# EAGLE design ECE411 (EAGLE 9.2.0)
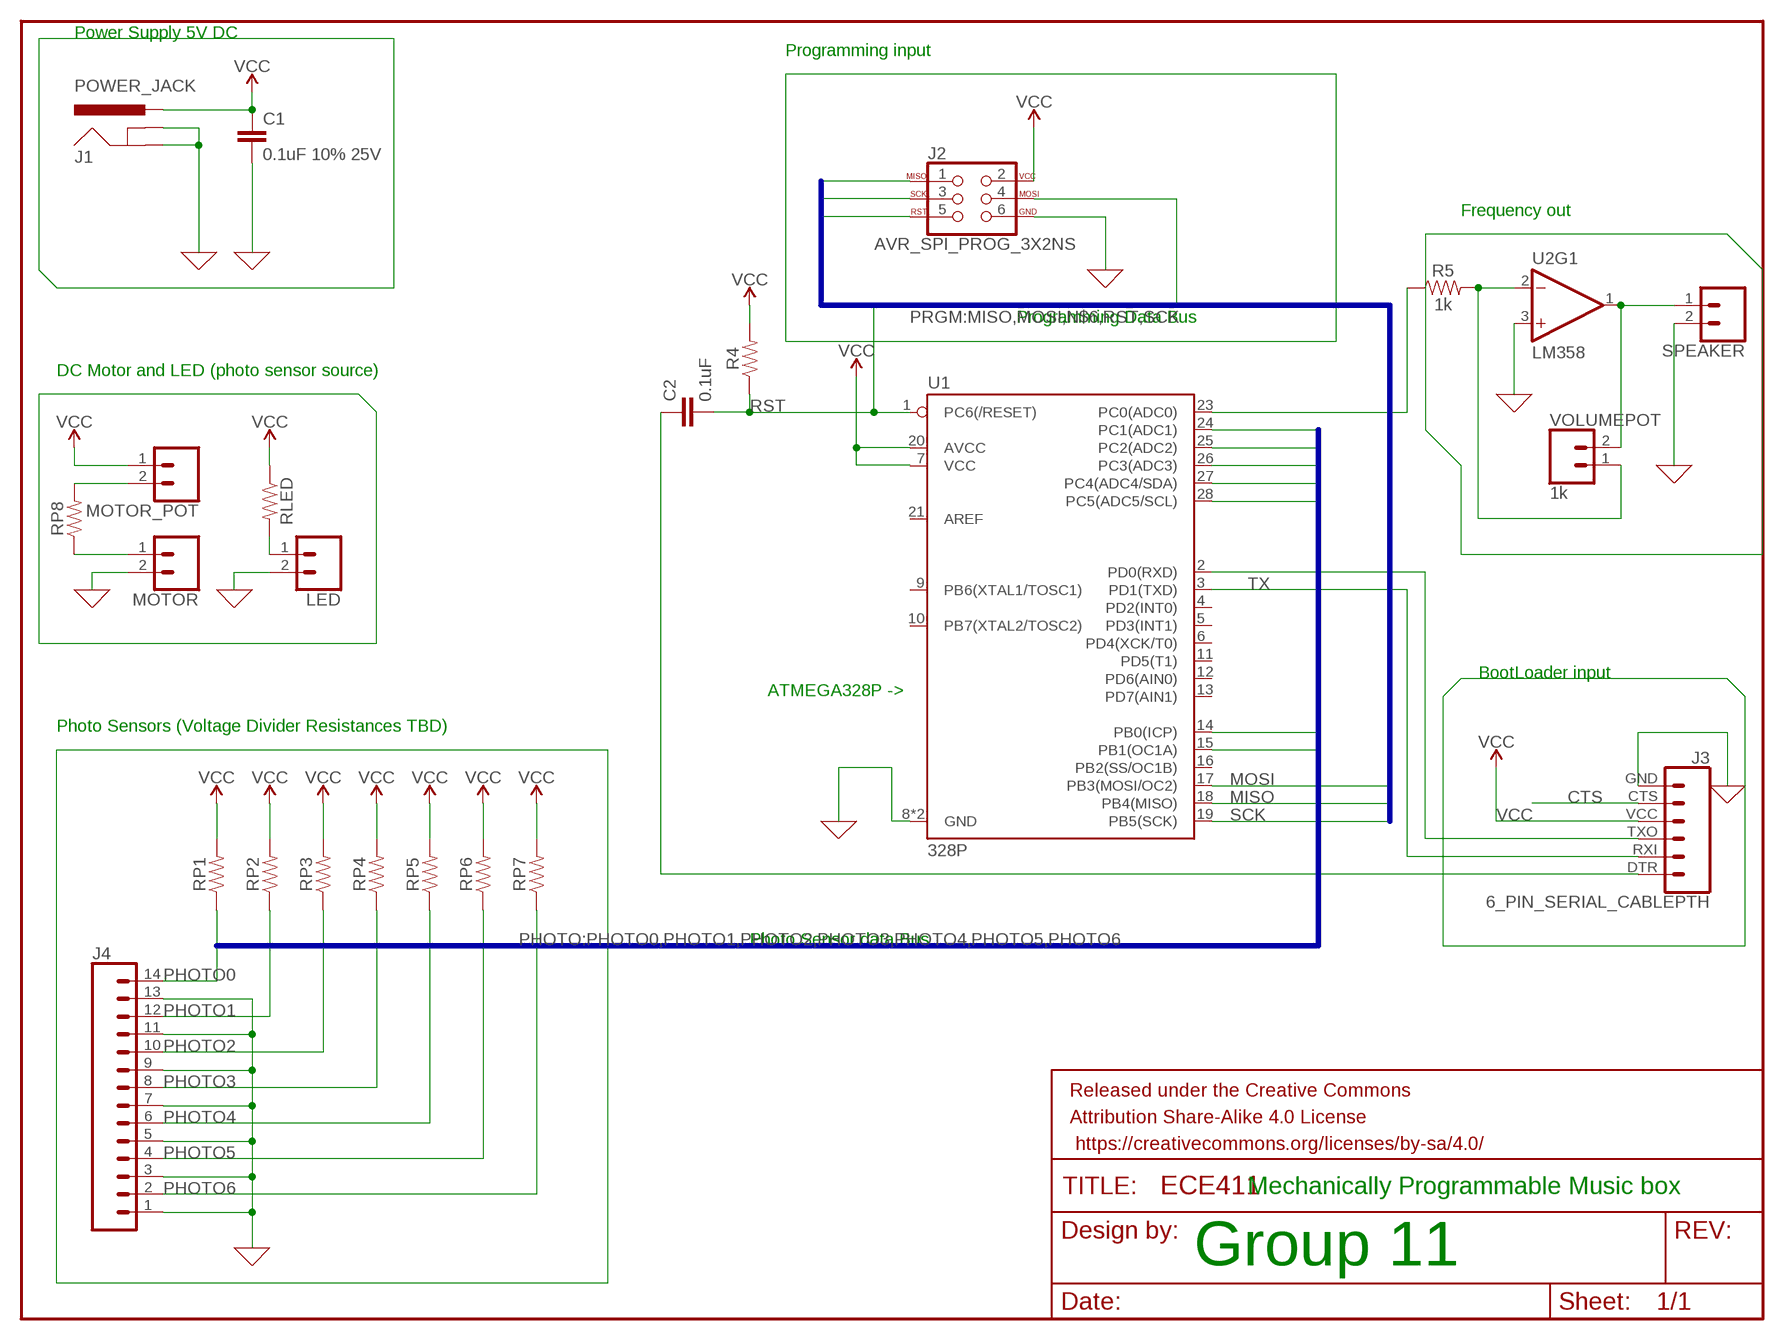
[diagram p0: schematic, sheet 1]

## Parts
C1  0.1uF 10% 25V  0.1UF-0603-25V-(+80/-20%)  [0603]
C2  0.1uF  0.1UF-0603-25V-(+80/-20%)  [0603]
FRAME1  FRAME-LETTER  [CREATIVE_COMMONS]
J1  POWER_JACK  [POWER_JACK_PTH]
J2  AVR_SPI_PROG_3X2NS  [2X3-NS]
J3  6_PIN_SERIAL_CABLEPTH  [FTDI_BASIC]
J4  CONN_14  [1X14]
LED  CONN_02  [1X02]
MOTOR  CONN_02  [1X02]
MOTOR_POT  CONN_02  [1X02]
R4  RESISTOR0805  [0805]
R5  1k  1KOHM-0603-1/10W-1%  [0603]
RLED  RESISTOR0603  [0603]
RP1  RESISTOR0603  [0603]
RP2  RESISTOR0603  [0603]
RP3  RESISTOR0603  [0603]
RP4  RESISTOR0603  [0603]
RP5  RESISTOR0603  [0603]
RP6  RESISTOR0603  [0603]
RP7  RESISTOR0603  [0603]
RP8  RESISTOR0603  [0603]
SPEAKER  CONN_02  [1X02]
U1  328P  ATMEGA328P_PDIP  [DIP28]
U2  LM358  [DIP08]
VOLUMEPOT  1k  CONN_02  [1X02]

## Nets
0: C1.2 J1.GND J1.GNDBREAK J2.6 J3.GND J4.1 J4.3 J4.5 J4.7 J4.9 J4.11 J4.13 LED.2 MOTOR.2 SPEAKER.2 U1.8(GND) U1.22(GND) U2.3(+IN) ; supply symbol labelled GND
CTS: J3.CTS
MISO: J2.1 U1.18(PB4(MISO))
MOSI: J2.4 U1.17(PB3(MOSI/OC2))
N$1: R5.1 U1.23(PC0(ADC0))
N$2: MOTOR_POT.2 RP8.2
N$3: LED.1 RLED.2
N$4: J3.TXO U1.2(PD0(RXD))
N$5: C2.1 J3.DTR
N$7: MOTOR.1 RP8.1
N$8: R5.2 U2.2(-IN) VOLUMEPOT.1
N$9: SPEAKER.1 U2.1(OUT) VOLUMEPOT.2
PHOTO0: J4.14 RP1.1 U1.24(PC1(ADC1))
PHOTO1: J4.12 RP2.1 U1.25(PC2(ADC2))
PHOTO2: J4.10 RP3.1 U1.26(PC3(ADC3))
PHOTO3: J4.8 RP4.1 U1.27(PC4(ADC4/SDA))
PHOTO4: J4.6 RP5.1 U1.28(PC5(ADC5/SCL))
PHOTO5: J4.4 RP6.1 U1.14(PB0(ICP))
PHOTO6: J4.2 RP7.1 U1.15(PB1(OC1A))
RST: C2.2 J2.5 R4.1 U1.1(PC6(/RESET))
SCK: J2.3 U1.19(PB5(SCK))
TX: J3.RXI U1.3(PD1(TXD))
VCC: C1.1 J1.PWR J2.2 J3.VCC MOTOR_POT.1 R4.2 RLED.1 RP1.2 RP2.2 RP3.2 RP4.2 RP5.2 RP6.2 RP7.2 U1.7(VCC) U1.20(AVCC)
Unconnected: U1.4(PD2(INT0)) U1.5(PD3(INT1)) U1.6(PD4(XCK/T0)) U1.9(PB6(XTAL1/TOSC1)) U1.10(PB7(XTAL2/TOSC2)) U1.11(PD5(T1)) U1.12(PD6(AIN0)) U1.13(PD7(AIN1)) U1.16(PB2(SS/OC1B)) U1.21(AREF) U2.4(P$V-) U2.5(+IN) U2.6(-IN) U2.7(OUT) U2.8(P$V+)

## Buses
PHOTO:PHOTO0,PHOTO1,PHOTO2,PHOTO3,PHOTO4,PHOTO5,PHOTO6
PRGM:MISO,MOSI,N$6,RST,SCK

## Notes on the sheet
- Power Supply 5V DC
- Programming input
- Frequency out
- Programming Data Bus
- DC Motor and LED (photo sensor source)
- BootLoader input
- ATMEGA328P ->
- Photo Sensors (Voltage Divider Resistances TBD)
- Photo Sensor data Bus
- Mechanically Programmable Music box
- Group 11

## Library data of the parts
C1 = SparkFun-Capacitors:0.1UF: 0.1µF ceramic capacitors A capacitor is a passive two-terminal electrical component used to store electrical energy temporarily in an electric field.; PROD_ID: CAP-00810; VALUE: 0.1uF
C2 = SparkFun-Capacitors:0.1UF: 0.1µF ceramic capacitors A capacitor is a passive two-terminal electrical component used to store electrical energy temporarily in an electric field.; PROD_ID: CAP-00810
FRAME1 = SparkFun-Aesthetics:FRAME-LETTER: Schematic Frame - Letter Standard 8.5x11 US Letter frame
J1 = SparkFun-Connectors:POWER_JACK: Power Jack Connector This is the standard 5.5mm barrel jack for power. The PTH is the most common, proven, reliable, footprint. The Slot footprint only works if the mill layer is transmitted to the PCB fab house so be warned. Here are the connectors we sell at SparkFun: DC Barrel Power Jack/Connector <https://www.sparkfun.com/products/119> (PRT-00119) DC Barrel Power Jack/Connector (SMD) <https://www.sparkfun.com/products/12748> (PRT-12748) DC Barrel Jack Adapter - Breadboard Compatible <https://www.sparkfun.com/products/10811> (PRT-10811) It is used on this SparkFun product (and many, many others): SparkFun RedBoard - Programmed with Arduino <https://www.sparkfun.com/products/12757> (DEV-12757) Also, if you need a mating power supply or connector, please check these out: Wall Adapter Power Supply - 9VDC 650mA <https://www.sparkfun.com/products/298> (TOL-00298) DC Barrel Jack Adapter - Male <https://www.sparkfun.com/products/10287> (PRT-10287); PROD_ID: CONN-08197
J2 = SparkFun-Connectors:AVR_SPI_PROG_3X2: AVR ISP 6 Pin This is the reduced ISP connector for AVR programming. Common on Arduino. This footprint will take up less PCB space and can be used with a 10-pin to 6-pin adapter such as SKU: BOB-08508 **Special note about "TEST_POINT" package. The stop mask is on the top side, so if you want your programming test points to be on the bottom of your board, make sure to place this package on the bottom side of the board. This also ensure that the orientation to program from the bottom side will be correct. SparkFun Products: SparkFun ISP Pogo Adapter <https://www.sparkfun.com/products/11591> - NS Tiny AVR Programmer <https://www.sparkfun.com/products/11801> -PTH
J3 = SparkFun-Connectors:6_PIN_SERIAL_CABLE: 6-pin header connection for use with the "FTDI BASIC" pinout - CABLE SIDE. Also known as "Arduino Serial Program Header". This is used on a design to provide a 6-pin connection point for serial communication usually from a USB cable (D+/D-) to these headers (RX/TX). It also has the remaining pins necessary for programming in the Arduino evironment (DTR, GND, and sometimes VCC). Note, this device has "CABLE" in the name. It is intended to be used on a design that usually lives on the end of your USB cable and prvides the converter chip (FTDI232 or FTDI231x) to commnicate serial RX/TX. The "sister" device, named "TARGET" is inteneded to be used on a design that contains a target micro-controller that you wish to program. You can populate with some of these: Female Headers <https://www.sparkfun.com/products/115> (PRT-00115) For reference (or to suit your programming needs) check out these designs: SparkFun FTDI Basic Breakout - 5V <https://www.sparkfun.com/products/9716> (DEV-09716) SparkFun FTDI Basic Breakout - 3.3V <https://www.sparkfun.com/products/9873> (DEV-09873) SparkFun FTDI SmartBasic <https://www.sparkfun.com/products/12935> (DEV-12935) SparkFun Beefy 3 - FTDI Basic Breakout <https://www.sparkfun.com/products/13746> (DEV-13746)
J4 = SparkFun-Connectors:CONN_14: Multi connection point. Often used as Generic Header-pin footprint for 0.1 inch spaced/style header connections On any of the 0.1 inch spaced packages, you can populate with these: Break Away Headers - Straight <https://www.sparkfun.com/products/116> (PRT-00116) Break Away Male Headers - Right Angle <https://www.sparkfun.com/products/553> (PRT-00553) Female Headers <https://www.sparkfun.com/products/115> (PRT-00115) Break Away Headers - Machine Pin <https://www.sparkfun.com/products/117> (PRT-00117) Break Away Female Headers - Swiss Machine Pin <https://www.sparkfun.com/products/743> (PRT-00743) For SCREWTERMINALS and SPRING TERMINALS visit here: Screw Terimnals on SparkFun.com <https://www.sparkfun.com/search/results?term=Screw+Terminals> (5mm/3.5mm/2.54mm spacing) This device is also useful as a general connection point to wire up your design to another part of your project. Our various solder wires solder well into these plated through hole pads. Hook-Up Wire - Assortment (Stranded, 22 AWG) <https://www.sparkfun.com/products/11375> (PRT-11375) Hook-Up Wire - Assortment (Solid Core, 22 AWG) <https://www.sparkfun.com/products/11367> (PRT-11367) View the entire wire category on our website here <https://www.sparkfun.com/categories/141> Special notes: Molex polarized connector foot print use with SKU : PRT-08231 with associated crimp pins and housings. 1MM SMD Version SKU: PRT-10208 NOTES ON THE VARIANTS LOCK and LOCK_LONGPADS... This footprint was designed to help hold the alignment of a through-hole component (i.e. 6-pin header) while soldering it into place. You may notice that each hole has been shifted either up or down by 0.005 of an inch from it's more standard position (which is a perfectly straight line). This slight alteration caused the pins (the squares in the middle) to touch the edges of the holes. Because they are alternating, it causes a "brace" to hold the component in place. 0.005 has proven to be the perfect amount of "off-center" position when using our standard breakaway headers. Although looks a little odd when you look at the bare footprint, once you have a header in there, the alteration is very hard to notice. Also,if you push a header all the way into place, it is covered up entirely on the bottom side.
LED MOTOR MOTOR_POT SPEAKER VOLUMEPOT = SparkFun-Connectors:CONN_02: Multi connection point. Often used as Generic Header-pin footprint for 0.1 inch spaced/style header connections On any of the 0.1 inch spaced packages, you can populate with these: Break Away Headers - Straight <https://www.sparkfun.com/products/116> (PRT-00116) Break Away Male Headers - Right Angle <https://www.sparkfun.com/products/553> (PRT-00553) Female Headers <https://www.sparkfun.com/products/115> (PRT-00115) Break Away Headers - Machine Pin <https://www.sparkfun.com/products/117> (PRT-00117) Break Away Female Headers - Swiss Machine Pin <https://www.sparkfun.com/products/743> (PRT-00743) For SCREWTERMINALS and SPRING TERMINALS visit here: Screw Terimnals on SparkFun.com <https://www.sparkfun.com/search/results?term=Screw+Terminals> (5mm/3.5mm/2.54mm spacing) This device is also useful as a general connection point to wire up your design to another part of your project. Our various solder wires solder well into these plated through hole pads. Hook-Up Wire - Assortment (Stranded, 22 AWG) <https://www.sparkfun.com/products/11375> (PRT-11375) Hook-Up Wire - Assortment (Solid Core, 22 AWG) <https://www.sparkfun.com/products/11367> (PRT-11367) View the entire wire category on our website here <https://www.sparkfun.com/categories/141> Special notes: Molex polarized connector foot print use with: PRT-08233 with associated crimp pins and housings. 2.54_SCREWTERM for use with PRT-10571. 3.5mm Screw Terminal footprints for PRT-08084 5mm Screw Terminal footprints for use with PRT-08432
R4 RLED RP1-RP8 = SparkFun-Resistors:RESISTOR: Generic Resistor Package
R5 = SparkFun-Resistors:1KOHM: 1kΩ resistor A resistor is a passive two-terminal electrical component that implements electrical resistance as a circuit element. Resistors act to reduce current flow, and, at the same time, act to lower voltage levels within circuits. - Wikipedia; PROD_ID: RES-07856
U1 = SparkFun-IC-Microcontroller:ATMEGA328P_PDIP: Atmel 328P Through hole ATMEGA328P uC used in the Arduino 32kb flash, 1k EEPROM, 2k SRAM Datasheet <http://www.sparkfun.com/datasheets/Components/SMD/ATMega328.pdf> SparkFun Products Storefront component: AVR 28 Pin 20MHz 32K 6A/D - ATMega328P <https://www.sparkfun.com/products/9061> (COM-09061) SparkFun Simon Says - Through-Hole Soldering Kit <https://www.sparkfun.com/products/10547> (KIT-10547) SparkFun Learn to Solder - Simon Says <https://www.sparkfun.com/products/13708> (KIT-13708) SparkFun BigTime Watch Kit <https://www.sparkfun.com/products/11734> (KIT-11734) SparkFun ClockIt <https://www.sparkfun.com/products/10930> (KIT-10930) SparkFun Serial Enabled LCD Kit <https://www.sparkfun.com/products/10097> (LCD-10097) SparkFun Simon Tilts - Through Hole Soldering Kit <https://www.sparkfun.com/products/12634> (KIT-12634) SparkFun Frequency Counter Kit <https://www.sparkfun.com/products/10140> (KIT-10140) FabFM Radio Kit <https://www.sparkfun.com/products/11043> (KIT-11043) SparkFun Binary Blaster Kit <https://www.sparkfun.com/products/12037> (KIT-12037) SparkFun Metro-Gnome <https://www.sparkfun.com/products/9236> (KIT-09236) ATmega328 with Arduino Optiboot (Uno) <https://www.sparkfun.com/products/10524> (DEV-10524); PROD_ID: IC-09136
U2 = SparkFun-IC-Amplifiers:LM358: LM358 Jellybean op-amp Datasheet <http://www.sparkfun.com/datasheets/Components/General/LM358.pdf> SparkFun Products Op-Amp (Thru-Hole) - LM358 <https://www.sparkfun.com/products/9456> (COM-09456); PROD_ID: IC-09172

## Board
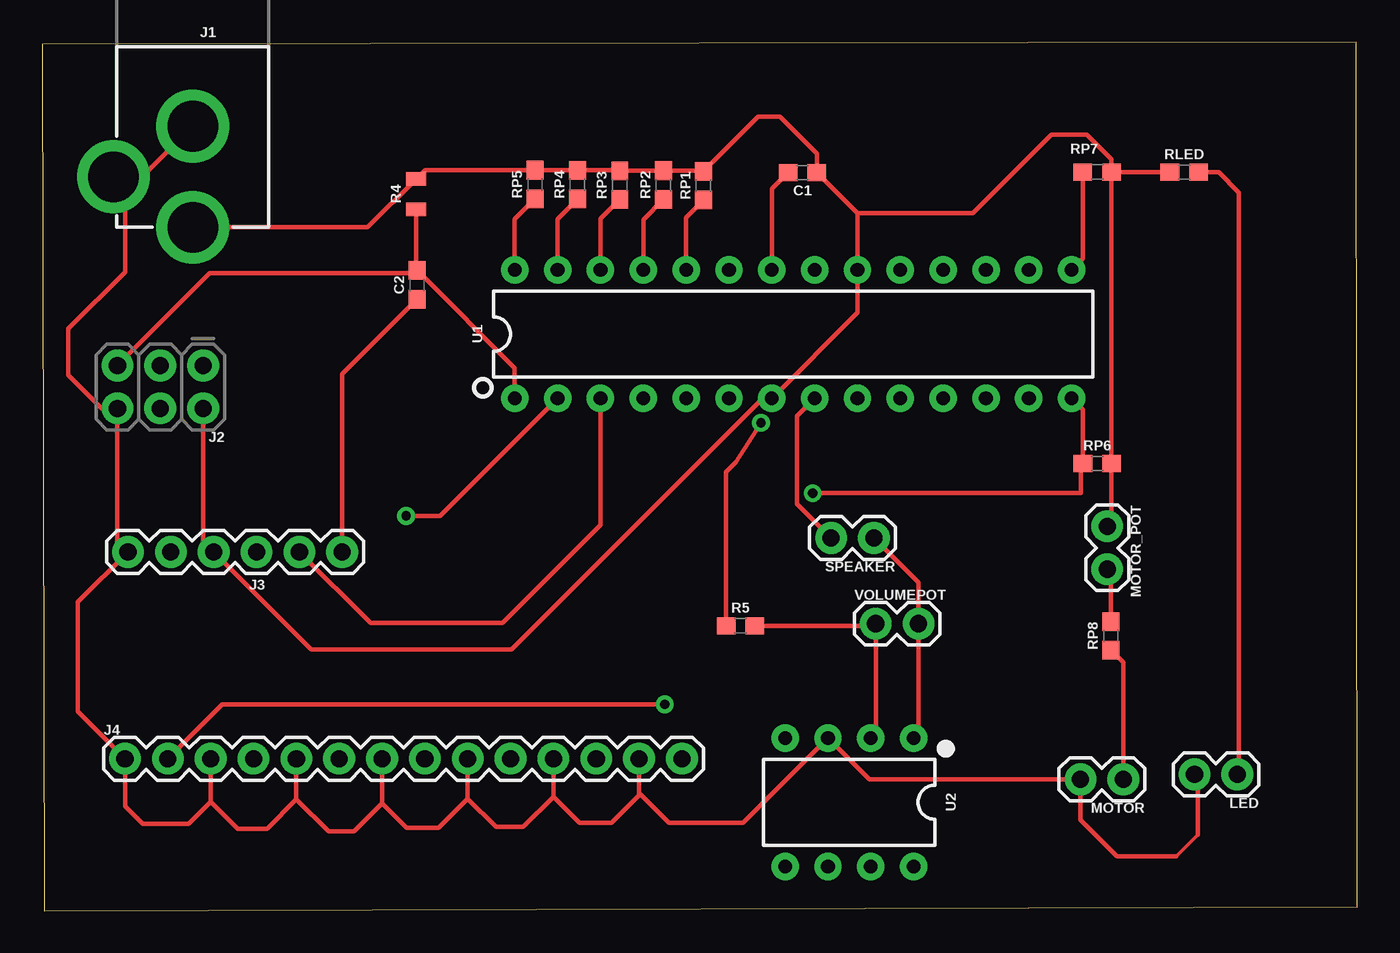
[diagram p1: board, top side]
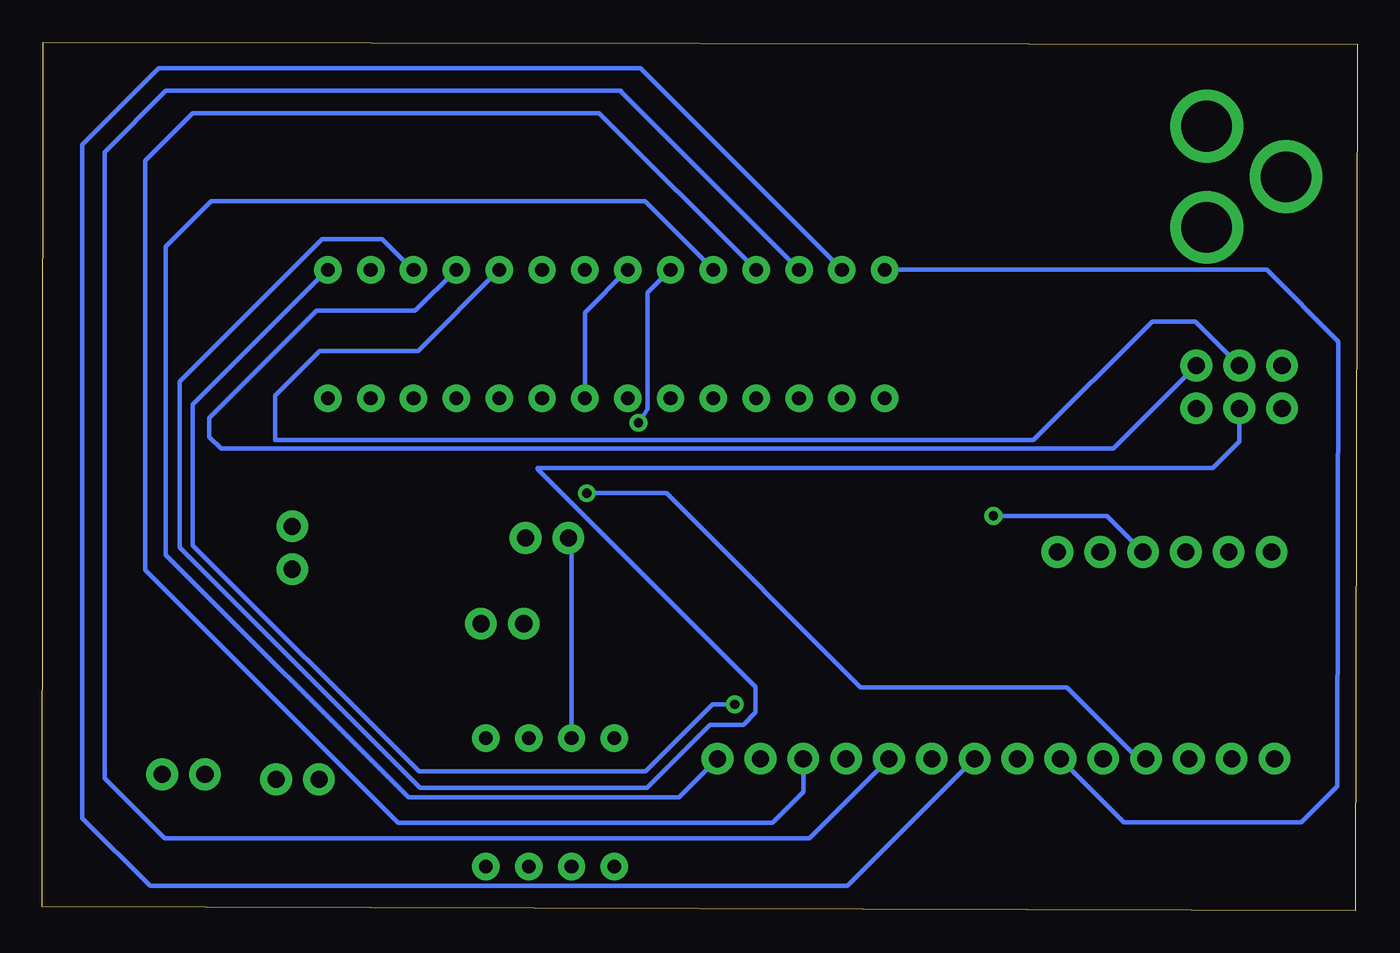
[diagram p2: board, bottom side, seen from below]

Size 77.98 x 51.5 mm. Coordinates in mm from the lower left corner, seen from the top.
Outline: 0.11,0 77.98,0.22 77.92,51.5 0,51.39 0.11,0
Copper layers (1*16): Top 0.035mm / dielectric 1.5mm / Bottom 0.035mm
Design rules "SparkFun": minimum track width 8mil, minimum drill 20mil, track to track 8mil, track to pad 8mil, pad to pad 8mil, via to via 8mil, smd to smd 8mil, copper to edge 8mil, drill to drill 8mil, minimum pad ring 12mil, minimum via ring 10mil, stop-mask expansion 4mil, vias tented up to drill 20mil, thermal gap 10mil

### Footprints (pad centres in the part's own frame; a part is rotated, then mirrored left to right if it is on the bottom)
0603 = smd 1.1 x 1: 1 -0.85,0; 2 0.85,0
POWER_JACK_PTH = drill 2.997 pad 4.318: GND 0,7.7; GNDBREAK 4.7,10.7; PWR 0,13.7
2X3-NS = drill 1.016 pad 1.88: 1 -2.54,-1.27; 2 -2.54,1.27; 3 0,-1.27; 4 0,1.27; 5 2.54,-1.27; 6 2.54,1.27
FTDI_BASIC = drill 1.016 pad 1.88: CTS 10.16,0; DTR 0,0; GND 12.7,0; RXI 2.54,0; TXO 5.08,0; VCC 7.62,0
1X14 = drill 1.016 pad 1.88: 1 0,0; 2 2.54,0; 3 5.08,0; 4 7.62,0; 5 10.16,0; 6 12.7,0; 7 15.24,0; 8 17.78,0; 9 20.32,0; 10 22.86,0; 11 25.4,0; 12 27.94,0; 13 30.48,0; 14 33.02,0
1X02 = drill 1.016 pad 1.88: 1 0,0; 2 2.54,0
0805 = smd 0.8 x 1.2: 1 -0.9,0; 2 0.9,0
DIP28 = drill 0.813 pad 1.626: 1 -16.51,-3.81; 2 -13.97,-3.81; 3 -11.43,-3.81; 4 -8.89,-3.81; 5 -6.35,-3.81; 6 -3.81,-3.81; 7 -1.27,-3.81; 8 1.27,-3.81; 9 3.81,-3.81; 10 6.35,-3.81; 11 8.89,-3.81; 12 11.43,-3.81; 13 13.97,-3.81; 14 16.51,-3.81; 15 16.51,3.81; 16 13.97,3.81; 17 11.43,3.81; 18 8.89,3.81; 19 6.35,3.81; 20 3.81,3.81; 21 1.27,3.81; 22 -1.27,3.81; 23 -3.81,3.81; 24 -6.35,3.81; 25 -8.89,3.81; 26 -11.43,3.81; 27 -13.97,3.81; 28 -16.51,3.81
DIP08 = drill 0.813 pad 1.626: 1 -3.81,-3.81; 2 -1.27,-3.81; 3 1.27,-3.81; 4 3.81,-3.81; 5 3.81,3.81; 6 1.27,3.81; 7 -1.27,3.81; 8 -3.81,3.81

### Placement (x,y rotation side)
C1  45.08,43.77 180 top
C2  22.23,37.11 90 top
FRAME1  -78.72,-9.24 0 top  (outside the outline)
J1  8.93,54.22 180 top
J2  7,31.05 180 top
J3  17.79,21.28 180 top
J4  4.91,9.01 0 top
LED  70.86,8.08 180 top
MOTOR  64.1,7.79 180 top
MOTOR_POT  63.15,22.79 270 top
R4  22.17,42.49 90 top
R5  41.4,16.89 0 top
RLED  67.71,43.78 0 top
RP1  39.21,42.99 90 top
RP2  36.84,43.03 90 top
RP3  34.25,43.02 90 top
RP4  31.74,43.05 90 top
RP5  29.23,43.06 90 top
RP6  62.55,26.51 0 top
RP7  62.55,43.8 0 top
RP8  63.37,16.3 90 top
SPEAKER  49.32,22.1 180 top
U1  44.53,34.19 0 top
U2  47.86,6.43 180 top
VOLUMEPOT  49.42,17.02 0 top

### Tracks (layer width: path | path; a pad name or v marks a point on that pad's centre or on a via)
0
  Top 0.203: 67.25,3.22 68.53,4.5
  Top 0.254: 9.99,6.45 8.69,5.15 5.96,5.15 4.91,6.19 J4.1 2.11,11.81 2.11,18.3 J3.GND 4.46,21.9 J2.6 3.53,29.78 1.54,31.77 1.54,34.5 4.92,37.88 4.92,42.83 J1.GNDBREAK 5.93,43.52 J1.GND | 9.99,6.45 J4.3 | 9.99,6.45 11.58,4.87 13.33,4.87 15.07,6.61 | 15.07,6.61 J4.5 | 15.07,6.61 16.98,4.7 18.49,4.7 20.15,6.37 J4.7 20.15,6.37 21.61,4.91 23.5,4.91 25.23,6.64 | 25.23,6.64 J4.9 | 25.23,6.64 26.92,4.96 28.52,4.96 30.31,6.75 | 30.31,6.75 J4.11 | 30.31,6.75 31.87,5.19 33.75,5.19 35.39,6.84 J4.13 35.39,6.99 37.18,5.21 41.56,5.21 U2.3 49.04,7.79 MOTOR.2 61.56,5.38 63.72,3.22 67.25,3.22 | 68.53,4.5 68.53,7.87 LED.2 | SPEAKER.2 44.75,24.12 44.75,29.34 U1.8 | U1.22 43.26,42.8 C1.2
  Bottom 0.254: U1.8 45.8,35.46 U1.22 | U2.3 46.59,21.92 SPEAKER.2
MISO
  Bottom 0.254: J2.1 14.47,27.4 67.37,27.4 68.07,28.09 68.07,29.21 61.71,35.57 55.85,35.57 U1.18
MOSI
  Bottom 0.254: U1.17 56.02,38 57.83,39.81 61.38,39.81 69.81,31.38 69.81,21.53 55.57,7.29 42.11,7.29 38.38,11.02 36.4,11.02 35.67,11.75 35.67,13.25 48.6,26.18 48.6,26.25 8.56,26.25 7,27.81 J2.4
N$1  (via drill 0.55)
  Top 0.254: R5.1 40.55,26.02 41.12,26.6 v42.62,28.93
  Bottom 0.254: U1.23 42.08,36.64 42.08,29.76 42.59,28.94 v42.62,28.93
N$2
  Top 0.254: RP8.2 63.37,20.03 MOTOR_POT.2
N$3
  Top 0.254: RLED.2 69.76,43.78 70.95,42.59 70.95,8.17 LED.1
N$4  (via drill 0.55)
  Top 0.254: U1.2 23.59,23.41 v21.58,23.41
  Bottom 0.254: v21.58,23.41 14.85,23.41 J3.TXO
N$5
  Top 0.254: J3.DTR 17.79,31.81 C2.1
N$7
  Top 0.254: MOTOR.1 64.1,14.71 RP8.1
N$8
  Top 0.254: R5.2 49.29,16.89 VOLUMEPOT.1 49.42,10.53 U2.2
N$9
  Top 0.254: U2.1 51.96,10.53 VOLUMEPOT.2 51.96,19.45 SPEAKER.1
PHOTO0
  Top 0.254: RP1.1 38.18,41.11 U1.24
  Bottom 0.254: J4.14 40.23,6.71 56.26,6.71 70.64,21.09 70.64,21.39 70.64,39.38 67.97,42.06 42.24,42.06 U1.24
PHOTO1
  Top 0.254: RP2.1 35.64,40.98 U1.25
  Bottom 0.254: J4.12 32.85,7.05 34.69,5.21 56.87,5.21 71.87,20.21 71.87,44.49 69.05,47.3 44.96,47.3 35.66,38 U1.25
PHOTO2
  Top 0.254: RP3.1 33.1,41.03 U1.26
  Bottom 0.254: J4.10 32.48,4.3 70.73,4.3 74.28,7.85 74.28,44.99 70.65,48.61 43.66,48.61 43.66,48.56 U1.26
PHOTO3
  Top 0.254: RP4.1 30.56,41.02 U1.27
  Bottom 0.254: J4.8 30.24,1.47 71.58,1.47 75.6,5.48 75.6,5.49 75.6,45.42 71.07,49.95 42.51,49.95 U1.27
PHOTO4
  Top 0.254: RP5.1 28.02,41 U1.28
  Bottom 0.254: J4.6 13.85,5.25 3.31,5.25 1.19,7.37 1.13,33.75 5.38,38 U1.28
PHOTO5  (via drill 0.55)
  Top 0.254: U1.14 61.7,29.72 RP6.1 61.58,26.51 61.58,24.75 v45.69,24.75
  Bottom 0.254: v45.69,24.75 40.96,24.75 29.46,13.25 17.21,13.25 12.97,9.01 J4.4
PHOTO6  (via drill 0.55)
  Top 0.254: RP7.1 61.7,38.66 U1.15 | J4.2 10.68,12.24 v36.91,12.24
  Bottom 0.254: v36.91,12.24 38.23,12.24 42.21,8.26 55.63,8.26 69.04,21.67 69.04,30 U1.15
RST
  Top 0.254: 22.4,37.79 C2.2 22.17,38.02 R4.1 | 22.4,37.79 28.02,32.17 U1.1 | J2.5 9.93,37.79 22.4,37.79
SCK
  Bottom 0.254: J2.3 9.62,34.94 12.17,34.94 19.19,27.91 64.17,27.91 64.17,30.54 61.52,33.19 55.69,33.19 U1.19
TX
  Top 0.254: U1.3 33.1,22.86 27.3,17.06 19.47,17.06 J3.RXI
VCC
  Top 0.254: J1.PWR 19.3,40.52 R4.2 22.69,43.91 RP5.2 31.73,43.91 RP4.2 34.22,43.9 RP3.2 RP2.2 39.17,43.88 RP1.2 42.44,47.07 43.75,47.07 45.93,44.9 C1.1 48.34,41.36 | 48.34,41.36 U1.20 48.34,35.46 U1.7 42.72,30.38 27.82,15.49 15.96,15.49 J3.VCC 9.54,21.9 J2.2 | 48.34,41.36 55.17,41.36 59.84,46.03 61.93,46.03 63.4,44.56 RP7.2 | RP7.2 63.42,43.78 RLED.1 | RP7.2 RP6.2 63.4,23.05 MOTOR_POT.1